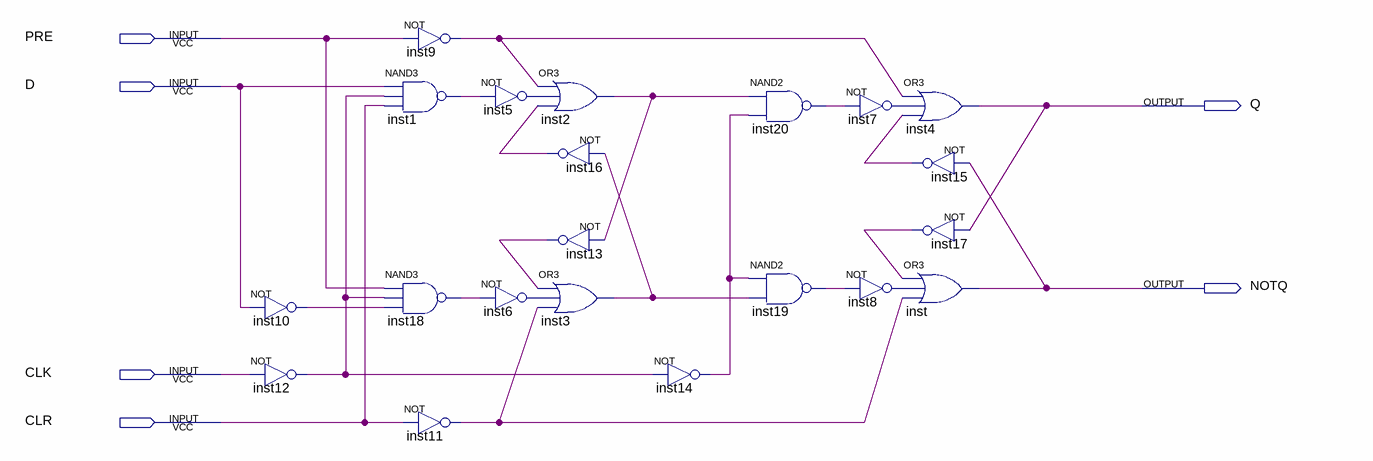
[diagram p0: schematic sheet]
// Quartus schematic dflipflop.bdf as structural Verilog: 21 symbols, 6 pins
module dflipflop (
  input  PRE,
  input  D,
  input  CLK,
  input  CLR,
  output Q,
  output NOTQ
);

  wire inst1_out, inst2_out, inst3_out, inst5_out, inst6_out, inst7_out, inst8_out, inst9_out, inst10_out,
       inst11_out, inst12_out, inst13_out, inst14_out, inst15_out, inst16_out, inst17_out, inst18_out,
       inst19_out, inst20_out;

  not inst10 (inst10_out, D);
  not inst12 (inst12_out, CLK);
  nand inst1 (inst1_out, D, inst12_out, CLR);
  nand inst18 (inst18_out, PRE, inst12_out, inst10_out);
  not inst9 (inst9_out, PRE);
  not inst11 (inst11_out, CLR);
  or inst2 (inst2_out, inst9_out, inst5_out, inst16_out);
  not inst5 (inst5_out, inst1_out);
  not inst16 (inst16_out, inst3_out);
  not inst13 (inst13_out, inst2_out);
  or inst3 (inst3_out, inst13_out, inst6_out, inst11_out);
  not inst6 (inst6_out, inst18_out);
  not inst14 (inst14_out, inst12_out);
  nand inst20 (inst20_out, inst2_out, inst14_out);
  nand inst19 (inst19_out, inst14_out, inst3_out);
  not inst7 (inst7_out, inst20_out);
  not inst8 (inst8_out, inst19_out);
  or inst4 (Q, inst9_out, inst7_out, inst15_out);
  not inst15 (inst15_out, NOTQ);
  not inst17 (inst17_out, Q);
  or inst (NOTQ, inst17_out, inst8_out, inst11_out);
endmodule
